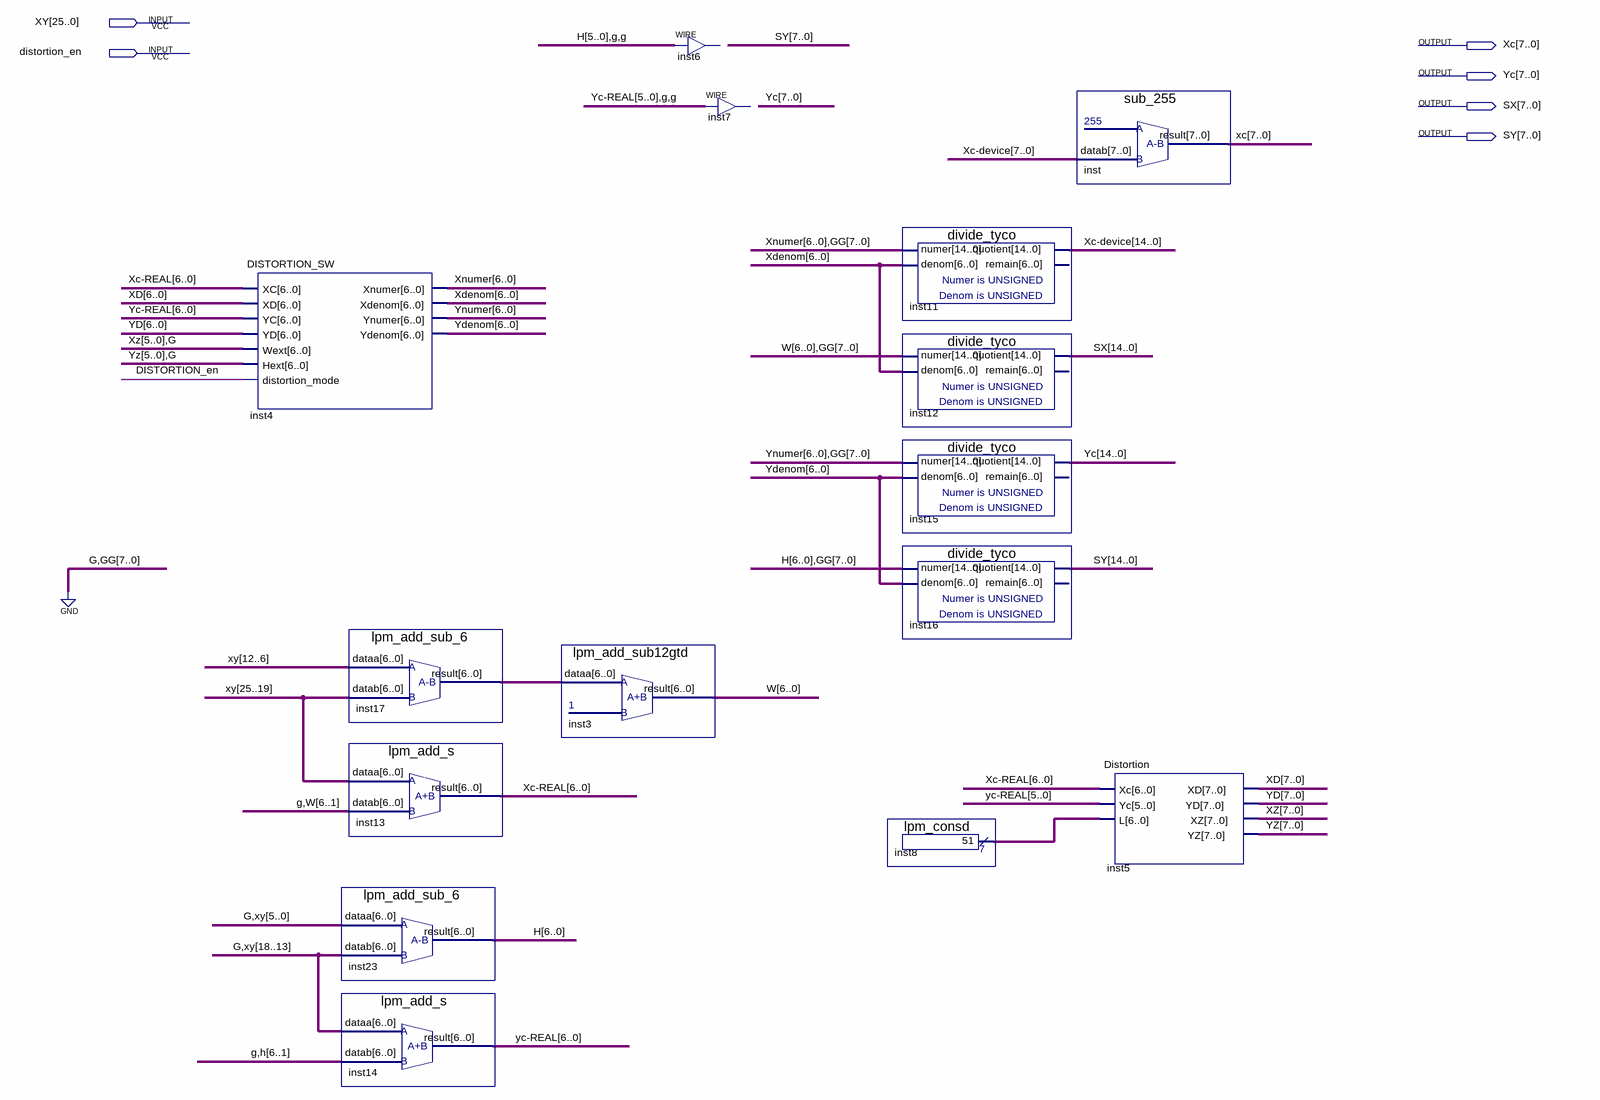
[diagram p0: schematic sheet]
// Quartus schematic TYCO_COORDS_htpa.bdf as structural Verilog: 15 symbols, 6 pins
module TYCO_COORDS_htpa (
  input  [25:0] XY,
  input  distortion_en,
  output [7:0] Xc,
  output [14:0] Yc,
  output [14:0] SX,
  output [14:0] SY
);

  wire [6:0] H, inst8_result, inst17_result, W, \Xc-REAL , Xdenom, Xnumer, \yc-REAL , Ydenom, Ynumer;
  wire [7:0] XD, Xz, YD, Yz;
  wire [14:0] \Xc-device ;

  DISTORTION_SW inst4 (
    .XC(\Xc-REAL ), .XD(XD[6:0]), .YC(\yc-REAL ), .YD(YD[6:0]), .Wext({Xz[5:0], 1'b0}),
    .Hext({Yz[5:0], 1'b0}), .distortion_mode(distortion_en), .Xnumer(Xnumer), .Xdenom(Xdenom),
    .Ynumer(Ynumer), .Ydenom(Ydenom));
  lpm_add_sub_6 inst17 (.dataa(XY[12:6]), .datab(XY[25:19]), .result(inst17_result));
  lpm_add_s inst13 (.dataa(XY[25:19]), .datab({1'b0, W[6:1]}), .result(\Xc-REAL ));
  lpm_add_sub_6 inst23 (.dataa({1'b0, XY[5:0]}), .datab({1'b0, XY[18:13]}), .result(H));
  lpm_add_s inst14 (.dataa({1'b0, XY[18:13]}), .datab({1'b0, H[6:1]}), .result(\yc-REAL ));
  lpm_add_sub12gtd inst3 (.dataa(inst17_result), .result(W));
  // WIRE inst6 has open pins
  // WIRE inst7 has open pins
  divide_tyco inst11 (.numer({Xnumer, {8{1'b0}}}), .denom(Xdenom), .quotient(\Xc-device ));  // open: remain
  divide_tyco inst12 (.numer({W, {8{1'b0}}}), .denom(Xdenom), .quotient(SX));  // open: remain
  divide_tyco inst15 (.numer({Ynumer, {8{1'b0}}}), .denom(Ydenom), .quotient(Yc));  // open: remain
  divide_tyco inst16 (.numer({H, {8{1'b0}}}), .denom(Ydenom), .quotient(SY));  // open: remain
  lpm_consd inst8 (.result(inst8_result));
  sub_255 inst (.datab(\Xc-device [7:0]), .result(Xc));
  Distortion inst5 (.Xc(\Xc-REAL ), .Yc(\yc-REAL [5:0]), .L(inst8_result), .XD(XD), .YD(YD), .XZ(Xz), .YZ(Yz));
endmodule
